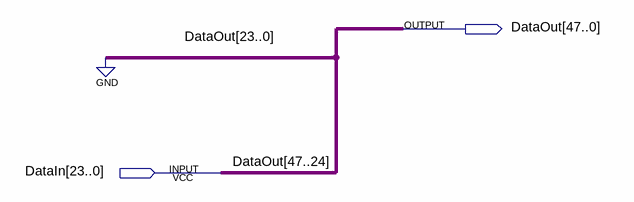
[diagram p0: schematic sheet]
// Quartus schematic Extended_Divisor.bdf as structural Verilog: 0 symbols, 2 pins
module Extended_Divisor (
  input  [23:0] DataIn,
  output [47:0] DataOut
);


  assign DataOut = {DataIn, {24{1'b0}}};
endmodule
